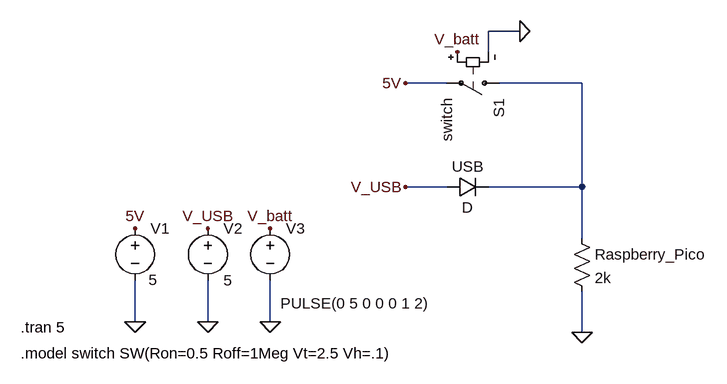
[diagram p0: schematic ORingSim.asc]
ORingSim.asc, the LTspice schematic file:
Version 4.1
SHEET 1 1004 680
WIRE 704 -144 656 -144
WIRE 656 -112 656 -144
WIRE 592 -64 528 -64
WIRE 800 -64 672 -64
WIRE 592 96 528 96
WIRE 800 96 800 -64
WIRE 800 96 656 96
WIRE 800 176 800 96
WIRE 112 304 112 240
WIRE 224 304 224 240
WIRE 320 304 320 240
WIRE 800 320 800 256
FLAG 112 304 0
FLAG 224 304 0
FLAG 112 160 5V
FLAG 224 160 V_USB
FLAG 800 320 0
FLAG 528 -64 5V
FLAG 528 96 V_USB
FLAG 320 304 0
FLAG 320 160 V_batt
FLAG 608 -112 V_batt
FLAG 704 -144 0
SYMBOL voltage 112 144 R0
WINDOW 3 21 95 Left 2
WINDOW 123 0 0 Left 0
WINDOW 39 0 0 Left 0
SYMATTR InstName V1
SYMATTR Value 5
SYMBOL voltage 224 144 R0
WINDOW 123 0 0 Left 0
WINDOW 39 0 0 Left 0
SYMATTR InstName V2
SYMATTR Value 5
SYMBOL diode 592 112 R270
WINDOW 0 32 32 VTop 2
WINDOW 3 0 32 VBottom 2
SYMATTR InstName USB
SYMBOL res 784 160 R0
SYMATTR InstName Raspberry_Pico
SYMATTR Value 2k
SYMBOL sw 688 -64 R90
SYMATTR InstName S1
SYMATTR Value switch
SYMBOL voltage 320 144 R0
WINDOW 3 16 131 Left 2
WINDOW 123 0 0 Left 0
WINDOW 39 0 0 Left 0
SYMATTR InstName V3
SYMATTR Value PULSE(0 5 0 0 0 1 2)
TEXT -64 312 Left 2 !.tran 5
TEXT -64 352 Left 2 !.model switch SW(Ron=0.5 Roff=1Meg Vt=2.5 Vh=.1)

The netlist it stands for:
* ORingSim.asc
V1 5V 0 5
V2 V_USB 0 5
D§USB V_USB N001 D
Raspberry_Pico N001 0 2k
S1 N001 5V V_batt 0 switch
V3 V_batt 0 PULSE(0 5 0 0 0 1 2)
.model D D
.lib standard.dio
.tran 5
.model switch SW(Ron=0.5 Roff=1Meg Vt=2.5 Vh=.1)
.backanno
.end